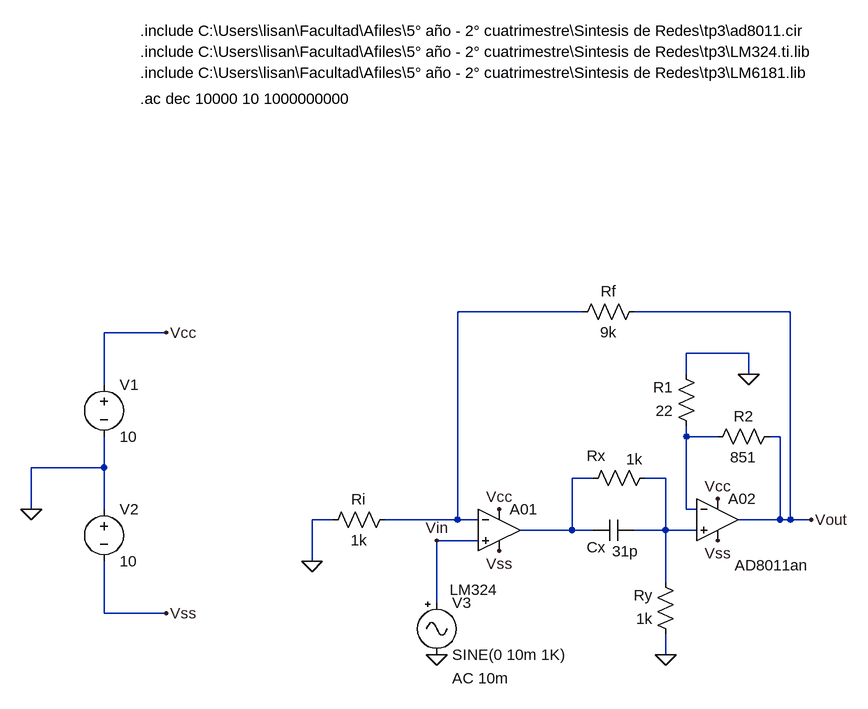
[diagram p0: schematic simulaciones.asc]
simulaciones.asc, the LTspice schematic file:
Version 4
SHEET 1 4928 940
WIRE 288 224 96 224
WIRE 608 224 368 224
WIRE -352 256 -448 256
WIRE 544 288 448 288
WIRE 448 320 448 288
WIRE 544 320 544 288
WIRE -448 336 -448 256
WIRE 448 416 448 400
WIRE 496 416 448 416
WIRE 592 416 576 416
WIRE -448 464 -448 416
WIRE -448 464 -560 464
WIRE 304 480 272 480
WIRE 416 480 384 480
WIRE -560 528 -560 464
WIRE -448 528 -448 464
WIRE 448 528 448 416
WIRE 464 528 448 528
WIRE -96 544 -128 544
WIRE 96 544 96 224
WIRE 96 544 -16 544
WIRE 128 544 96 544
WIRE 592 544 592 416
WIRE 592 544 528 544
WIRE 608 544 608 224
WIRE 608 544 592 544
WIRE 640 544 608 544
WIRE 272 560 272 480
WIRE 272 560 192 560
WIRE 304 560 272 560
WIRE 416 560 416 480
WIRE 416 560 368 560
WIRE 464 560 416 560
WIRE 128 576 64 576
WIRE -128 608 -128 544
WIRE 416 640 416 560
WIRE 64 672 64 576
WIRE -448 688 -448 608
WIRE -352 688 -448 688
WIRE 416 752 416 720
FLAG -128 608 0
FLAG -560 528 0
FLAG -352 256 Vcc
FLAG -352 688 Vss
FLAG 160 592 Vss
FLAG 496 576 Vss
FLAG 160 528 Vcc
FLAG 496 512 Vcc
FLAG 544 320 0
FLAG 64 752 0
FLAG 64 576 Vin
FLAG 640 544 Vout
FLAG 416 752 0
SYMBOL OpAmps\\opamp2 160 496 R0
WINDOW 3 -76 156 Left 2
SYMATTR Value LM324
SYMATTR InstName A01
SYMBOL OpAmps\\opamp2 496 480 R0
WINDOW 3 26 134 Left 2
SYMATTR Value AD8011an
SYMATTR InstName A02
SYMBOL res 0 528 R90
WINDOW 0 0 56 VBottom 2
WINDOW 3 32 56 VTop 2
SYMATTR InstName Ri
SYMATTR Value 1k
SYMATTR SpiceLine tol=1
SYMBOL voltage -448 320 R0
WINDOW 123 0 0 Left 0
WINDOW 39 0 0 Left 0
SYMATTR InstName V1
SYMATTR Value 10
SYMBOL voltage -448 512 R0
WINDOW 123 0 0 Left 0
WINDOW 39 0 0 Left 0
SYMATTR InstName V2
SYMATTR Value 10
SYMBOL res 384 208 R90
WINDOW 0 0 56 VBottom 2
WINDOW 3 32 56 VTop 2
SYMATTR InstName Rf
SYMATTR Value 9k
SYMBOL res 592 400 R90
WINDOW 0 0 56 VBottom 2
WINDOW 3 32 56 VTop 2
SYMATTR InstName R2
SYMATTR Value 851
SYMBOL res 464 416 R180
WINDOW 0 36 76 Left 2
WINDOW 3 36 40 Left 2
SYMATTR InstName R1
SYMATTR Value 22
SYMBOL Misc\\signal 64 656 R0
WINDOW 123 24 132 Left 2
WINDOW 39 0 0 Left 0
SYMATTR InstName V3
SYMATTR Value SINE(0 10m 1K)
SYMATTR Value2 AC 10m
SYMBOL cap 368 544 R90
WINDOW 0 58 59 VBottom 2
WINDOW 3 33 14 VTop 2
SYMATTR InstName Cx
SYMATTR Value 31p
SYMBOL res 400 464 R90
WINDOW 0 -3 91 VBottom 2
WINDOW 3 -29 32 VTop 2
SYMATTR InstName Rx
SYMATTR Value 1k
SYMBOL res 432 736 R180
WINDOW 0 36 76 Left 2
WINDOW 3 36 40 Left 2
SYMATTR InstName Ry
SYMATTR Value 1k
TEXT -392 -176 Left 2 !.include C:\\Users\\lisan\\Facultad\\Afiles\\5° año - 2° cuatrimestre\\Sintesis de Redes\\tp3\\LM324.ti.lib
TEXT -392 -144 Left 2 !.include C:\\Users\\lisan\\Facultad\\Afiles\\5° año - 2° cuatrimestre\\Sintesis de Redes\\tp3\\LM6181.lib
TEXT -392 -104 Left 2 !.ac dec 10000 10 1000000000
TEXT -392 -208 Left 2 !.include C:\\Users\\lisan\\Facultad\\Afiles\\5° año - 2° cuatrimestre\\Sintesis de Redes\\tp3\\ad8011.cir

The netlist it stands for:
* simulaciones.asc
XA01 Vin N001 Vcc Vss N003 LM324  ; pins In+ In- V+ V- OUT
XA02 N004 N002 Vcc Vss Vout AD8011an  ; pins In+ In- V+ V- OUT
Ri N001 0 1k tol=1
V1 Vcc 0 10
V2 0 Vss 10
Rf Vout N001 9k
R2 Vout N002 851
R1 N002 0 22
V3 Vin 0 SINE(0 10m 1K) AC 10m
Cx N004 N003 31p
Rx N004 N003 1k
Ry 0 N004 1k
.include C:\Users\lisan\Facultad\Afiles\5° año - 2° cuatrimestre\Sintesis de Redes\tp3\LM324.ti.lib
.include C:\Users\lisan\Facultad\Afiles\5° año - 2° cuatrimestre\Sintesis de Redes\tp3\LM6181.lib
.ac dec 10000 10 1000000000
.include C:\Users\lisan\Facultad\Afiles\5° año - 2° cuatrimestre\Sintesis de Redes\tp3\ad8011.cir
.backanno
.end